# Altium schematic sheet 25.SchDoc
size 381 x 254 mm
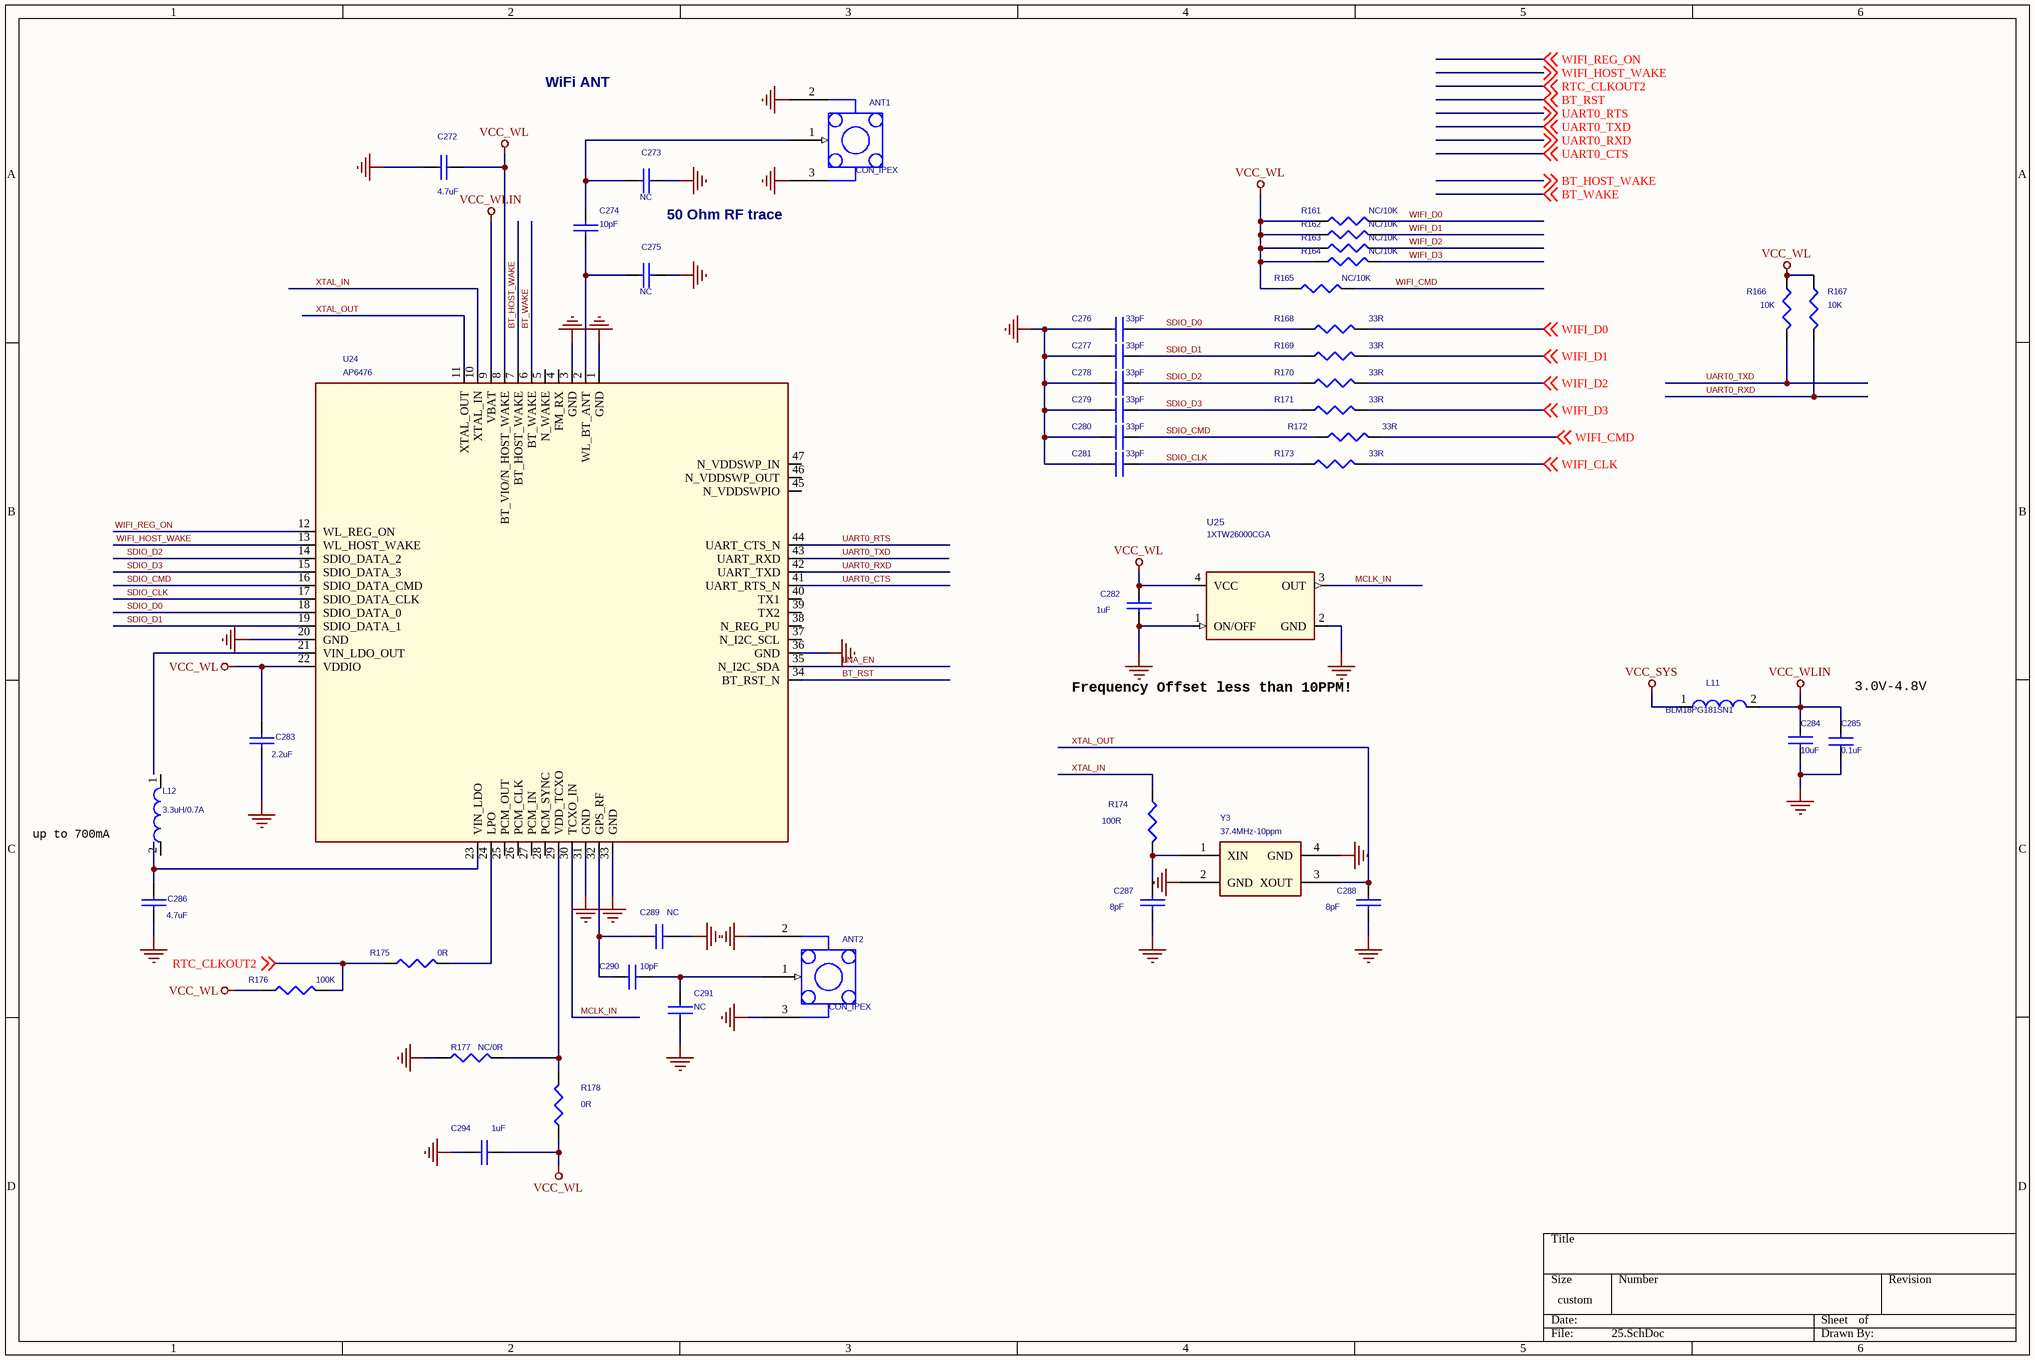
[diagram p0: 25.SchDoc]

## Parts
ANT1  CON_IPEX  [ANT-JACKA-1]
ANT2  CON_IPEX  [ANT-JACKA-1]
C272  4.7uF  [C0603]
C273  NC  [c0402]
C274  10pF  [c0402]
C275  NC  [c0402]
C276  33pF  [c0402]
C277  33pF  [c0402]
C278  33pF  [c0402]
C279  33pF  [c0402]
C280  33pF  [c0402]
C281  33pF  [c0402]
C282  1uF  [c0402]
C283  2.2uF  [C0402]
C284  10uF  [C0402]
C285  0.1uF  [C0402]
C286  4.7uF  [C0603]
C287  8pF  [c0402]
C288  8pF  [c0402]
C289  NC  [C0402]
C290  10pF  [C0402]
C291  NC  [C0402]
C294  1uF  [c0402]
L11  BLM18PG181SN1  [L0603]
L12  3.3uH/0.7A  [IND-3X3]
R161  NC/10K  [R0402]
R162  NC/10K  [R0402]
R163  NC/10K  [R0402]
R164  NC/10K  [R0402]
R165  NC/10K  [R0402]
R166  10K  [r0402]
R167  10K  [r0402]
R168  33R  [R0402]
R169  33R  [R0402]
R170  33R  [R0402]
R171  33R  [R0402]
R172  33R  [R0402]
R173  33R  [R0402]
R174  100R  [R0402]
R175  0R  [R0402]
R176  100K  [R0402]
R177  NC/0R  [R0402]
R178  0R  [R0402]
U24  AP6476  [AP6XXX]
U25  1XTW26000CGA  [CRY-D3225]
Y3  37.4MHz-10ppm  [CRY-3225]

## Nets
GND: ANT1.2(GND1) ANT1.3(GND2) ANT2.2(GND1) ANT2.3(GND2) C272.2 C273.2 C275.2 C276.2 C277.2 C278.2 C279.2 C280.2 C281.2 C282.1 C283.1 C284.2 C285.1 C286.1 C287.1 C288.1 C289.2 C291.2 C294.2 R177.2 U24.1(GND) U24.3(GND) U24.20(GND) U24.31(GND) U24.33(GND) U24.36(GND) U25.1(ON/OFF) U25.2(GND) Y3.2(GND) Y3.4(GND)
VCC_SYS: L11.1
VCC_WL: C272.1 C282.2 C283.2 C294.1 R161.1 R162.1 R163.1 R164.1 R165.1 R166.2 R167.2 R176.1 R178.2 U24.8(BT_VIO/N_HOST_WAKE) U24.22(VDDIO) U25.4(VCC)
VCC_WLIN: C284.1 C285.2 L11.2 U24.9(VBAT)
BT_HOST_WAKE: U24.7(BT_HOST_WAKE) ; off-sheet BT_HOST_WAKE
BT_RST: U24.34(BT_RST_N) ; off-sheet BT_RST
BT_WAKE: U24.6(BT_WAKE) ; off-sheet BT_WAKE
LNA_EN: U24.35(N_I2C_SDA)
MCLK_IN: U24.30(TCXO_IN) U25.3(OUT)
RTC_CLKOUT2: R175.1 R176.2 ; off-sheet RTC_CLKOUT2
SDIO_CLK: C281.1 R173.1 U24.17(SDIO_DATA_CLK)
SDIO_CMD: C280.1 R172.1 U24.16(SDIO_DATA_CMD)
SDIO_D0: C276.1 R168.1 U24.18(SDIO_DATA_0)
SDIO_D1: C277.1 R169.1 U24.19(SDIO_DATA_1)
SDIO_D2: C278.1 R170.1 U24.14(SDIO_DATA_2)
SDIO_D3: C279.1 R171.1 U24.15(SDIO_DATA_3)
UART0_CTS: U24.41(UART_RTS_N) ; off-sheet UART0_CTS
UART0_RTS: U24.44(UART_CTS_N) ; off-sheet UART0_RTS
UART0_RXD: R167.1 U24.42(UART_TXD) ; off-sheet UART0_RXD
UART0_TXD: R166.1 U24.43(UART_RXD) ; off-sheet UART0_TXD
WIFI_CLK: R173.2 ; off-sheet WIFI_CLK
WIFI_CMD: R165.2 R172.2 ; off-sheet WIFI_CMD
WIFI_D0: R161.2 R168.2 ; off-sheet WIFI_D0
WIFI_D1: R162.2 R169.2 ; off-sheet WIFI_D1
WIFI_D2: R163.2 R170.2 ; off-sheet WIFI_D2
WIFI_D3: R164.2 R171.2 ; off-sheet WIFI_D3
WIFI_HOST_WAKE: U24.13(WL_HOST_WAKE) ; off-sheet WIFI_HOST_WAKE
WIFI_REG_ON: U24.12(WL_REG_ON) ; off-sheet WIFI_REG_ON
XTAL_IN: R174.2 U24.10(XTAL_IN)
XTAL_OUT: C288.2 U24.11(XTAL_OUT) Y3.3(XOUT)
NetANT1_1: ANT1.1(IN) C273.1 C274.2
NetANT2_1: ANT2.1(IN) C290.2 C291.1
NetC274_1: C274.1 C275.1 U24.2(WL_BT_ANT)
NetC286_2: C286.2 U24.23(VIN_LDO)
NetC287_2: C287.2 R174.1 Y3.1(XIN)
NetC289_1: C289.1 C290.1 U24.32(GPS_RF)
NetR175_2: R175.2 U24.24(LPO)
NetR177_1: R177.1 R178.1 U24.29(VDD_TCXO)

Not connected (* = marked no-connect by the designer): L12 1 2; U24 4(FM_RX) 5(N_WAKE) 21(VIN_LDO_OUT) 25(PCM_OUT) 26(PCM_CLK) 27(PCM_IN) 28(PCM_SYNC) 37(N_I2C_SCL) 38(N_REG_PU) 39(TX2) 40(TX1) 45(N_VDDSWPIO) 46(N_VDDSWP_OUT) 47(N_VDDSWP_IN)

## Notes on the sheet
- WiFi ANT
- (near C273) 50 Ohm RF trace
- Frequency Offset less than 10PPM!
- (near C285) 3.0V-4.8V
- up to 700mA

## Library data of the parts
ANT1 ANT2 = CON_IPEX_0: Atanna jack,3pin,SMT; OriginalSymbolOrigin: (-100,200); PATH: ?; JEDEC_TYPE: ?
C272 C286 = CAPNP_Dup1_1: RoHS CHIP CAP 4.7uF +10/-10% X5R; BOM_VALUE: 0; BOM_TYPE: 30
C273 C275 = CAPNP_Dup1_1: BOM_TYPE: 30; BOM_VALUE: 0
C274 = CAPNP_Dup1_1: RoHS CHIP CAP 10pF +10/-10% X7R; BOM_TYPE: 20; BOM_VALUE: 0
C276-C281 = CAP NP_Dup1: CAP,MLCC,10uF,+/-10%,X5R,6.3V,SMD0805
C282 C288 C294 = CAPNP_Dup1_1: RoHS CHIP CAP 8pF +/-1% NPO; BOM_VALUE: 0; BOM_TYPE: 30
C283 = CAPNP_Dup1_1: RoHS CHIP CAP 2.2uF +10/-10% X5R; BOM_VALUE: 0; BOM_TYPE: 30
C284 = CAP NP_Dup2: CAP,MLCC,4.7uF,+/-10%,X5R,6.3V,SMD0603; Supplier P/N: GRM21BR61C106K; Supplier: MURATA
C285 = CAP NP_Dup2: CAP,MLCC,100nF,+/-10%,X7R,6.3V,SMD0402; Supplier P/N: GRM21BR61C106K; Supplier: MURATA
C287 = CAPNP_Dup1_1: RoHS CHIP CAP 8pF +/-1% NPO; BOM_TYPE: 30; BOM_VALUE: 0
C289-C291 = CAP NP_Dup2: RoHS CHIP CAP 2.2uF +10/-10% X5R
L11 = INDUCTOR: Part number: SM01V00480I; Vendor: TAITECH; Type: SMD
L12 = INDUCTOR: CoilInd,Shielded(SHLD),1.5uH@100KHz,+/-30%,0.7A,40mOhm,SMD,3.0*3.0*2.0; BOM_TYPE: 20; BOM_VALUE: 0
R161-R165 = RESISTOR_Dup1: ROHS CHIP RES 10K 1/16W +/-5%
R166 R167 = RESISTOR_4: ROHS CHIP RES 10K 1/16W +/-5%; BOM_TYPE: 20; BOM_VALUE: 0
R168-R173 R177 R178 = RESISTOR_Dup1: RES,thick film,33Ohm,+/-5%,1/16W,SMD0402
R174 = R_0: ROHS CHIP RES 100 Ohm 1/16W +/-5%; BOM_VALUE: 0; BOM_TYPE: 20
R175 = RESISTOR_Dup1: ROHS CHIP RES 200 Ohm 1/16W +/-5%; BOM_TYPE: 20; BOM_VALUE: 0
R176 = RESISTOR_Dup1: ROHS CHIP RES 100K 1/16W +/-5%; BOM_VALUE: 0; BOM_TYPE: 20
U24 = AP6493_0: WIFI&BT; BOM_VALUE: 8; Device: AMPAK_SIP; QVL: AMPAK; ORCAD_LIB: MODULE; BOM_TYPE: 10
U25 = CRYSTAL OSC: 1XTW26000CGA  KDS TCXO 26MHZ 1.8V 0.5PPM ,SMD3225
Y3 = CRYSTAL-4_0: Crystal,24.000MHz,+/-20ppm,12pF,SMD3225,-10°C ~ +60   °C; BOM_TYPE: 62; BOM_VALUE: 0